# Altium schematic sheet AUDIO.SchDoc
size A4
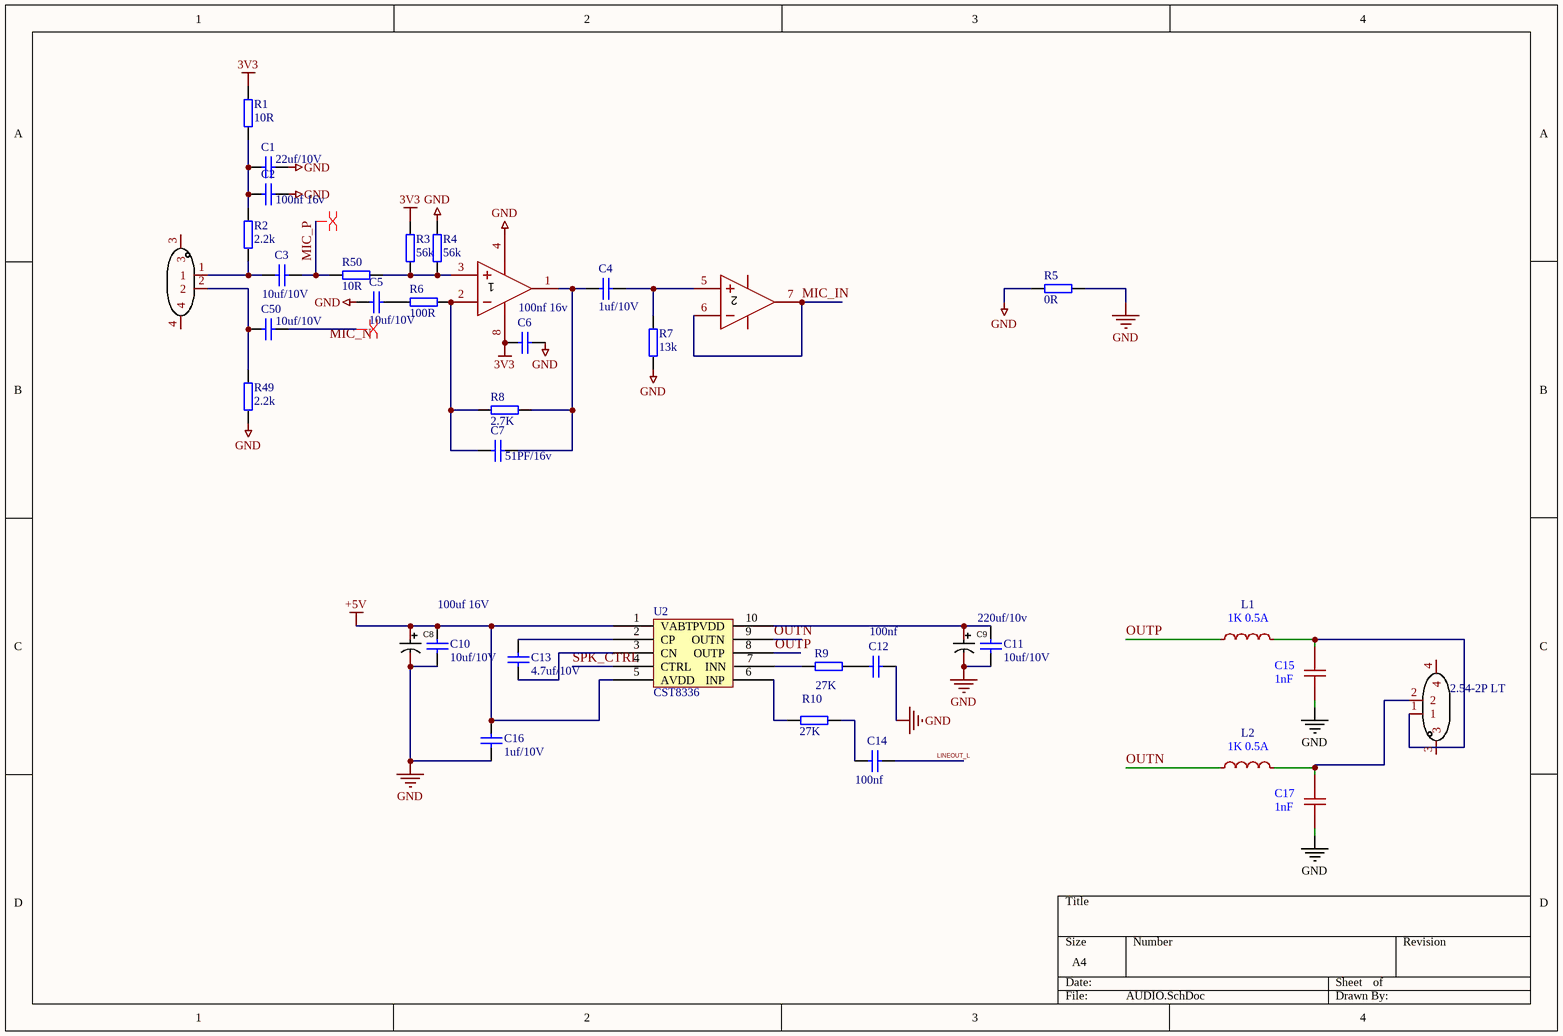
[diagram p0: AUDIO.SchDoc]

## Parts
C1  22uf/10V  [0603_C]
C2  100nf 16v  [0603_C]
C3  10uf/10V  [0603_C]
C4  1uf/10V  [0603_C]
C5  10uf/10V  [0603_C]
C6  100nf 16v  [0603_C]
C7  51PF/16v  [0603_C]
C8  100uf 16V  [CAP-SMD_5*5.4]
C9  220uf/10v  [SMD 6.3*7.7]
C10  10uf/10V  [0603_C]
C11  10uf/10V  [0603_C]
C12  100nf  [0603_C]
C13  4.7uf/10V  [0603_C]
C14  100nf  [0603_C]
C15  1nF  [0603_c]
C16  1uf/10V  [0603_C]
C17  1nF  [0603_c]
C50  10uf/10V  [0603_C]
CON1  2.54-2P LT  [CONN-SMD_2.54-2PLT]
L1  1K 0.5A  [0805_R]
L2  1K 0.5A  [0805_R]
MK1  (no value)  [CONN-SMD_1.25-2PWT]
R1  10R  [0603_R]
R2  2.2k  [0603_R]
R3  56k  [0603_R]
R4  56k  [0603_R]
R5  0R  [0603_R]
R6  100R  [0603_R]
R7  13k  [0603_R]
R8  2.7K  [0603_R]
R9  27K  [0603_R]
R10  27K  [0603_R]
R49  2.2k  [0603_R]
R50  10R  [0603_R]
U1  lmv358b-sr  [SOP8]  (value not drawn)  (parts A,B of 2)
U2  CST8336  [ESOP-10]

## Nets
3V3: C6.2 R1.2 R3.2 U1.8(+VS)
+5V: C8.1 C10.1 C16.1 U2.1(VABT) U2.5(AVDD)
GND: C1.2 C2.2 C5.2 C6.1 C8.2 C9.2 C10.2 C11.2 C12.2 C15.1 C16.2 C17.1 R4.2 R5.1 R5.2 R7.2 R49.1 U1.4(-VS)
LINEOUT_L: C14.2
MIC_IN: U1.6(INB-) U1.7(OUTB)
MIC_P: C3.2 R50.2
OUTN: L2.1 U2.9(OUTN)
OUTP: L1.1 U2.8(OUTP)
SPK_CTRL: U2.4(CTRL)
NetC1_1: C1.1 C2.1 R1.1 R2.2
NetC3_1: C3.1 MK1.1 R2.1
NetC4_1: C4.1 R7.1 U1.5(INB+)
NetC4_2: C4.2 C7.2 R8.1 U1.1(OUTA)
NetC5_1: C5.1 R6.2
NetC7_1: C7.1 R6.1 R8.2 U1.2(INA-)
NetC9_1: C9.1 C11.1 U2.10(PVDD)
NetC12_1: C12.1 R9.1
NetC13_1: C13.1 U2.3(CN)
NetC13_2: C13.2 U2.2(CP)
NetC14_1: C14.1 R10.2
NetC15_2: C15.2 CON1.1 L1.2
NetC17_2: C17.2 CON1.2 L2.2
NetC50_1: C50.1 MK1.2 R49.2
NetR3_1: R3.1 R4.1 R50.1 U1.3(INA+)
NetR9_2: R9.2 U2.7(INN)
NetR10_1: R10.1 U2.6(INP)

Not connected (* = marked no-connect by the designer): C50 2; CON1 3 4; MK1 3 4

## Layout directives
differential pair: MIC_P, NetC50_2

## Notes on the sheet
- Labels drawn without touching a wire or pin: MIC_N

## Library data of the parts
C1-C7 C10-C14 C16 C50 = Cap: Capacitor; Value: 10nF; Published: 8-Jun-2000; Revision: July-2002: Re-released for DXP Platform.; Publisher: Altium Limited
C8 C9 = RVT1A221M0605_C72494: Symbol: RVT1A221M0605-C72494; Value: 220uF; Add into BOM: yes; Rated Voltage: 10V; Ripple Current: 90mA@120Hz; L: 5.4mm; Device: RVT1A221M0605_C72494; Supplier: LCSC; Manufacturer Part: RVT1A221M0605; Supplier Part: C72494; JLCPCB Part Class: Extended Part; Supplier Footprint: SMD,D6.3xL5.4mm; Datasheet: https://atta.szlcsc.com/upload/public/pdf/source/20170325/1490427950282.pdf; Convert to PCB: yes; Equivalent Series Resistance(ESR): -
C15 C17 = CAP_0805: Symbol: CapAcitance; Convert to PCB: yes; Device: CAP_0805; Add into BOM: yes; Supplier Footprint: 0805; Value: 1nF
CON1 MK1 = HC-1.25-2PLT: Add into BOM: yes; Pins Structure: 1x2P; Pitch: 1.25mm; Number of PINs Per Row: 2; Current Rating (Max): 2A; Symbol: HC-1.25-2PLT; Device: HC-1.25-2PLT; Supplier Part: C2845388; Manufacturer Part: HC-1.25-2PLT; Supplier Footprint: SMD,P=1.25mm; JLCPCB Part Class: Extended Part; Datasheet: https://atta.szlcsc.com/upload/public/pdf/source/20230707/8E5913B5A3195C18F5EE12EA4CB86B82.pdf; Supplier: LCSC; Convert to PCB: yes; Reference Series: -; Number of Pins: 2P; Number of Rows: 1; Row Spacing: -
L1 L2 = SBK201209T-102Y-N: Add into BOM: yes; Current Rating: 200mA; Circuits: 1; Symbol: SBK201209T-102Y-N; Device: SBK201209T-102Y-N; Supplier Part: C142036; Supplier Footprint: 0805; Datasheet: https://atta.szlcsc.com/upload/public/pdf/source/20181119/C285644_F4950E68CEB7BD9E18B05382B5272067.pdf; Supplier: LCSC; Convert to PCB: yes
  L1: Manufacturer Part: SBK201209T-102Y-N
  L2: Manufacturer Part: 1K 0.5A
R1-R10 R49 R50 = RES
U1 = lmv358b-sr: AddInBom: yes; ModelId: e81d2f7d937b4a6ab1dca543ff5d56a4; ModelName: SOIC-8_L4.9-W3.9-H1.7-LS6.0-P1.27; ModelTransform: 192.913,236.22,0,0,0,0,0,0,0; Number of Channels: 2; Gain Bandwidth Product: 1MHz; Vos - Input Offset Voltage: 4mV; Slew Rate: 700V/ms; Ib - Input Bias Current: 1pA; Common Mode Rejection Ratio(CMRR): 85dB; Quiescent Current: 80uA; Output Current: 100mA; Single supply: 2.5V~5.5V; Symbol: LMV358B-SR; SupplierPart: C248569; ManufacturerPart: LMV358B-SR; Supplier Footprint: SOIC-8; JLCPCB Part Class: Extended Part; Datasheet: https://item.szlcsc.com/datasheet/LMV358B-SR/245238.html; Supplier: LCSC; ConvertToPcb: yes; FootprintName: SOIC-8_L4.9-W3.9-P1.27-LS6.0-BL; Input Offset Current(Ios): 1pA; Dual Supply: -; Features: -